# EAGLE design CC-Dbg-TC2030-Adapter-v1.0.0-Rev-B (EAGLE 6.4)
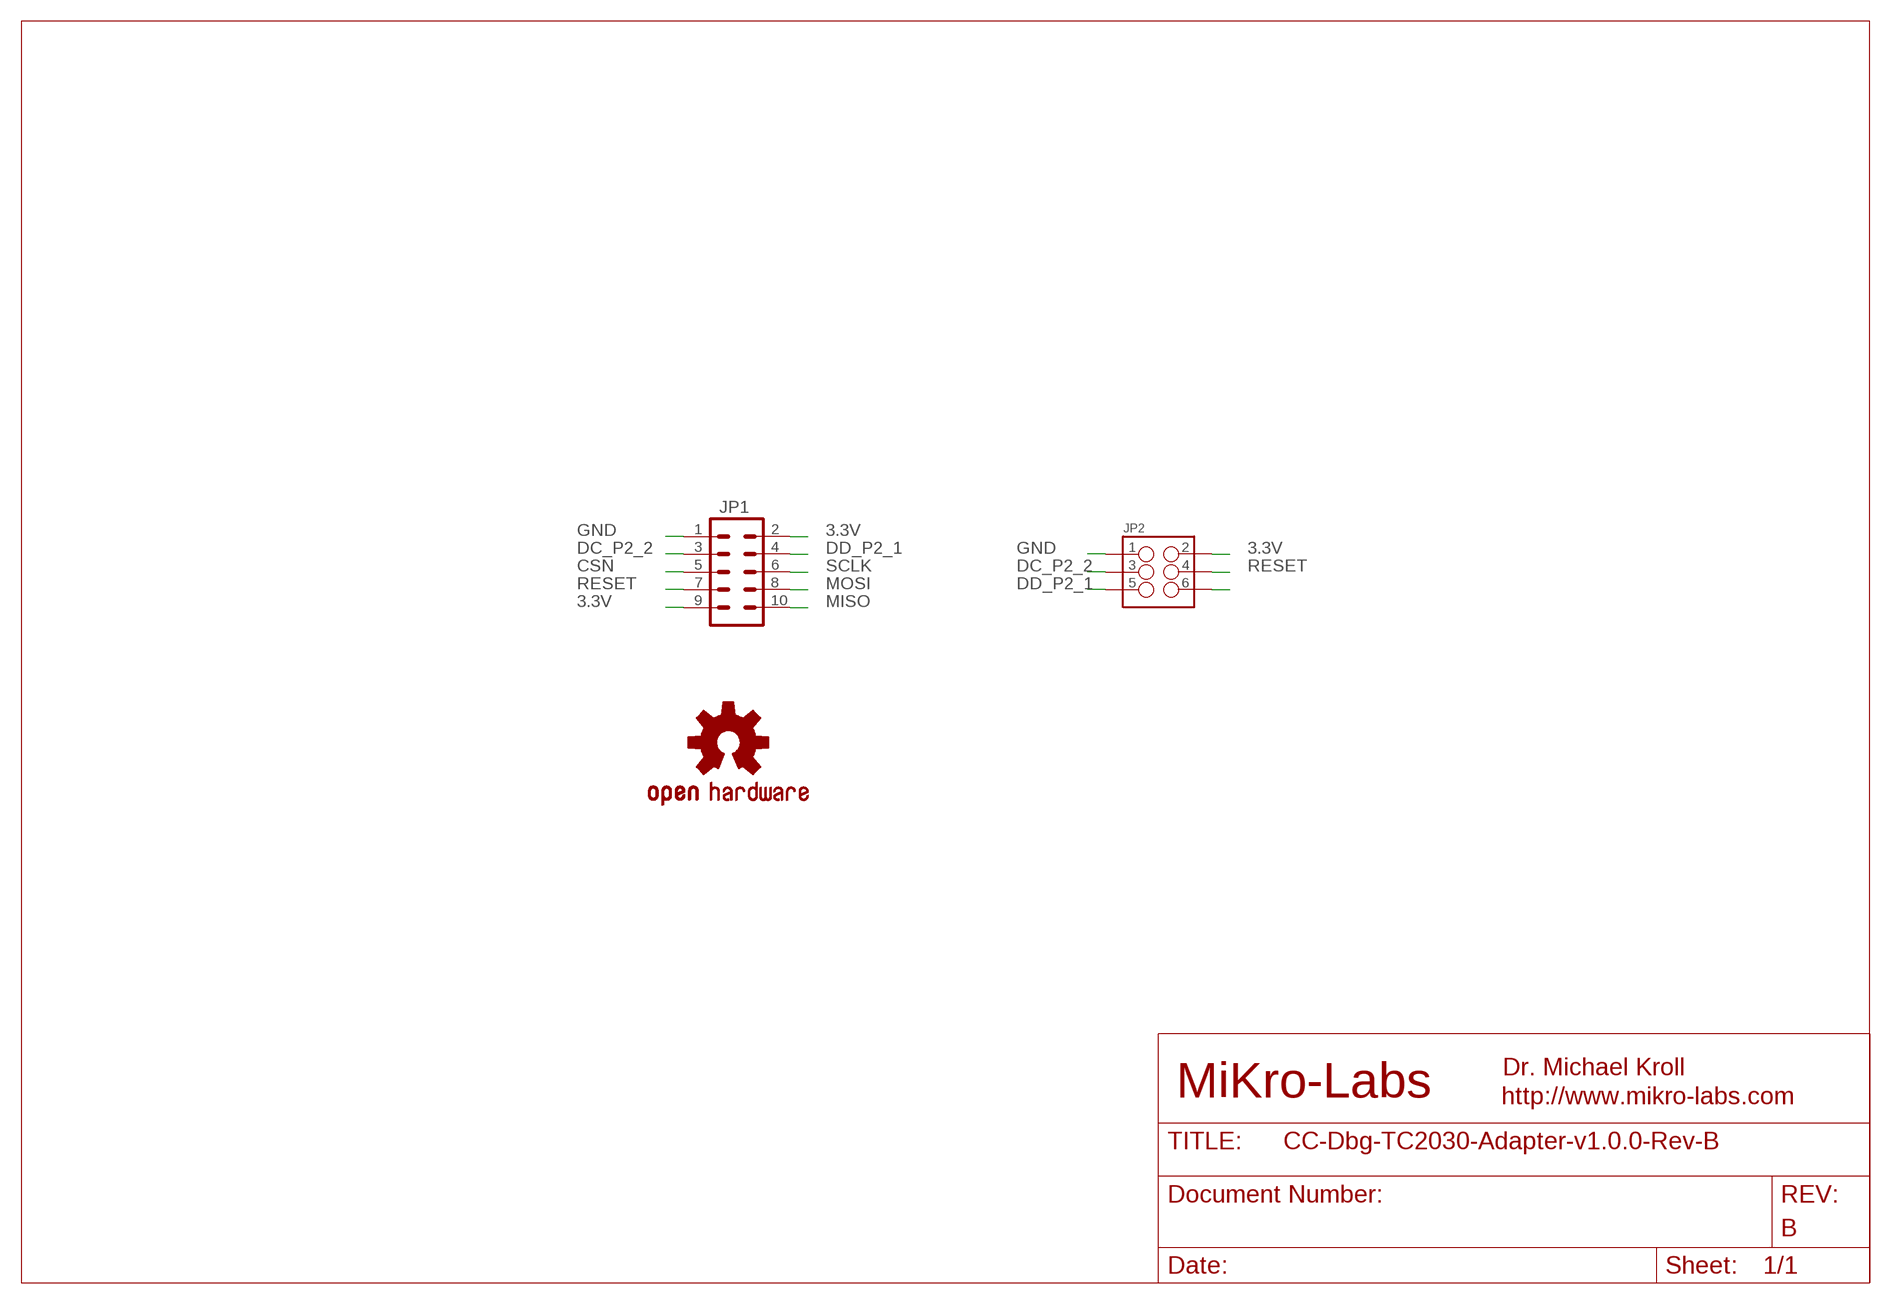
[diagram p0: schematic, sheet 1]

## Parts
JP1  M05X2SHD  [2X5-SHROUDED]
JP2  M03X2  [2X3-SHROUDED]
LOGO1  OSHW-LOGOS  [OSHW-LOGO-S]

## Nets
3.3V: JP1.2 JP1.9 JP2.2
CSN: JP1.5
DC_P2_2: JP1.3 JP2.3
DD_P2_1: JP1.4 JP2.5
GND: JP1.1 JP2.1
MISO: JP1.10
MOSI: JP1.8
N$6: JP2.6
RESET: JP1.7 JP2.4
SCLK: JP1.6

## Notes on the sheet
- Dr. Michael Kroll
- MiKro-Labs | http://www.mikro-labs.com
- B

## Library data of the parts
JP1 = SparkFun-Connectors:M05X2: Header 5x2 Standard 10-pin dual row 0.1" header. Commonly used with AVR-ISP. Use with Spark Fun Electronics SKU: PRT-00778
JP2 = SparkFun-Connectors:M03X2: 2x3 .1" header. Shrouded, with keying- CONN-10681 SMT- CONN-11415 Pogo pins- HW-11044; PROD_ID: CONN-10681
LOGO1 = SparkFun-Aesthetics:OSHW-LOGO: Open Source Hardware Logo This logo indicates the piece of hardware it is found on incorporates a OSHW license and/or adheres to the definition of open source hardware found here: http://freedomdefined.org/OSHW

## Board
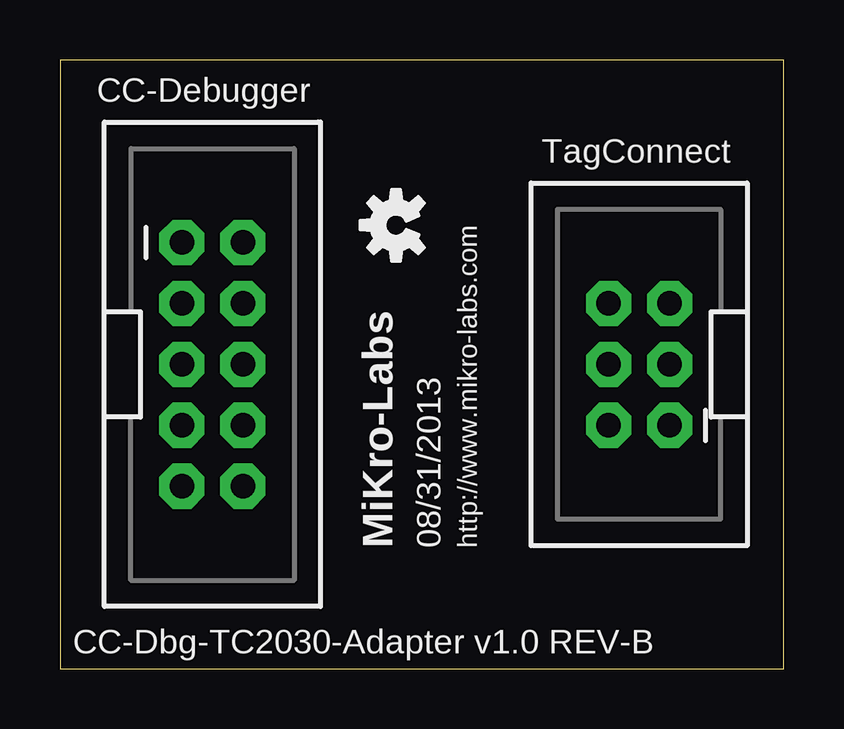
[diagram p1: board, top side]
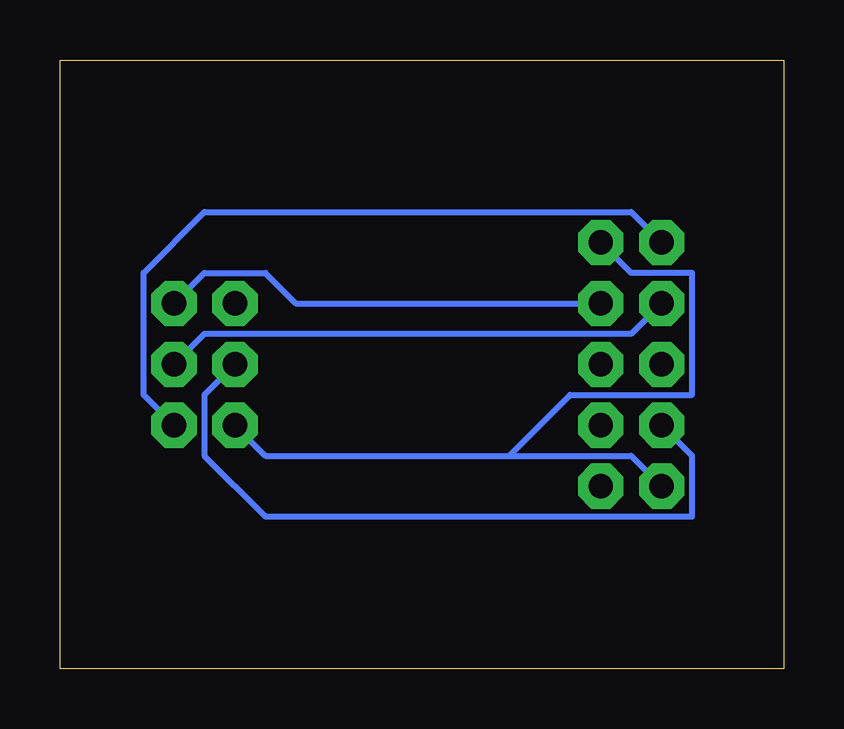
[diagram p2: board, bottom side, seen from below]

Size 30.15 x 25.39 mm. Coordinates in mm from the lower left corner, seen from the top.
Outline: 0,0 30.15,0 30.15,25.39 0,25.39 0,0
Copper layers (1*16): Top 0.035mm / dielectric 1.5mm / Bottom 0.035mm
Design rules "default": minimum track width 10mil, minimum drill 24mil, track to track 8mil, track to pad 8mil, pad to pad 8mil, via to via 8mil, smd to smd 8mil, copper to edge 40mil, drill to drill 8mil, minimum pad ring 10mil, minimum via ring 8mil, stop-mask expansion 4mil, vias tented up to drill 0mil, thermal gap 10mil

### Footprints (pad centres in the part's own frame; a part is rotated, then mirrored left to right if it is on the bottom)
2X5-SHROUDED = drill 1.016 pad 1.88 octagon: 1 -1.27,5.08; 2 1.27,5.08; 3 -1.27,2.54; 4 1.27,2.54; 5 -1.27,0; 6 1.27,0; 7 -1.27,-2.54; 8 1.27,-2.54; 9 -1.27,-5.08; 10 1.27,-5.08
2X3-SHROUDED = drill 1.016 pad 1.88 octagon: 1 -1.27,2.54; 2 1.27,2.54; 3 -1.27,0; 4 1.27,0; 5 -1.27,-2.54; 6 1.27,-2.54

### Placement (x,y rotation side)
JP1  6.35,12.7 0 top
JP2  24.13,12.7 180 top
LOGO1  14,18.5 90 top

### Tracks (layer width: path | path; a pad name or v marks a point on that pad's centre or on a via)
3.3V
  Bottom 0.254: JP1.9 6.35,8.89 11.43,8.89 | 11.43,8.89 21.59,8.89 JP2.2 | JP1.2 6.35,16.51 3.81,16.51 3.81,11.43 8.89,11.43 11.43,8.89
DC_P2_2
  Bottom 0.254: JP2.3 24.13,13.97 6.35,13.97 JP1.3
DD_P2_1
  Bottom 0.254: JP1.4 20.32,15.24 21.59,16.51 24.13,16.51 JP2.5
GND
  Bottom 0.254: JP1.1 6.35,19.05 24.13,19.05 26.67,16.51 26.67,11.43 JP2.1
RESET
  Bottom 0.254: JP1.7 3.81,8.89 3.81,6.35 21.59,6.35 24.13,8.89 24.13,11.43 JP2.4

### Text on the board
tNames: CC-Debugger | TagConnect | MiKro-Labs | 08/31/2013 | http://www.mikro-labs.com | CC-Dbg-TC2030-Adapter v1.0 REV-B